# Altium schematic sheet 08_nRF_RAM.SchDoc: SENSEI Base Board - nRF RAM
size A3; DrawnBy: Sebastian Frey; Organization: Integrated Systems Laboratory; DocumentNumber: 9; Revision: v1.1; SheetNumber: 9; SheetTotal: 12
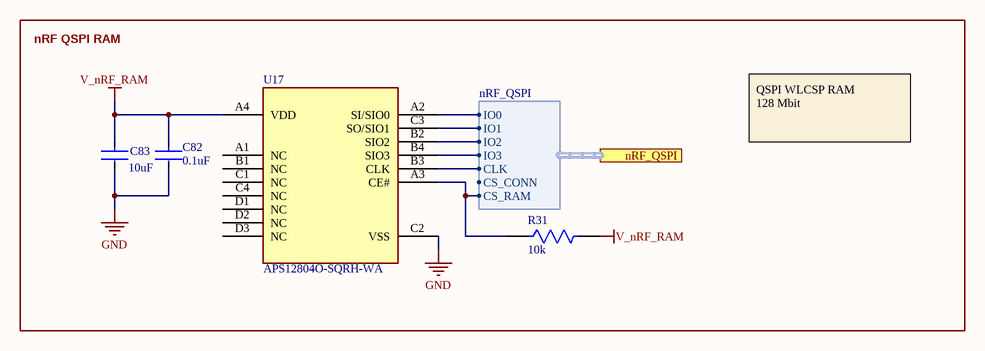
[diagram p0: 08_nRF_RAM.SchDoc]

## Parts
C82  Capacitance: 0.1uF  [FP-GRM033-0_03-IPC_C]  (hidden comment: GRM033Z71C104KE14D)
C83  Capacitance: 10uF  [FP-CL05A106MP5NUNC-IPC_C]  (hidden comment: CL05A106MP5NUNC)
R31  Resistance: 10k  [FP-RMCF0201-IPC_C]  (hidden comment: RMCF0201FT10K0)
U17  APS12804O-SQRH-WA  [APS12804O-SQRH-WA]

## Blocks framed on the sheet
nRF QSPI RAM: C82 C83 R31 U17

## Ports
nRF_QSPI (harness nRF_QSPI)

## Harnesses
nRF_QSPI: IO0, IO1, IO2, IO3, CLK, CS_CONN, CS_RAM

## Nets
GND: C82.2 C83.2 U17.C2(VSS)
V_nRF_RAM: C82.1 C83.1 R31.2 U17.A4(VDD)
NetR31_1: R31.1 U17.A3(CE#) ; port nRF_QSPI.CS_RAM
NetU17_A2: U17.A2(SI/SIO0) ; port nRF_QSPI.IO0
NetU17_B2: U17.B2(SIO2) ; port nRF_QSPI.IO2
NetU17_B3: U17.B3(CLK) ; port nRF_QSPI.CLK
NetU17_B4: U17.B4(SIO3) ; port nRF_QSPI.IO3
NetU17_C3: U17.C3(SO/SIO1) ; port nRF_QSPI.IO1

Not connected (* = marked no-connect by the designer): U17 A1(NC) B1(NC) C1(NC) C4(NC) D1(NC) D2(NC) D3(NC)

## Notes on the sheet
- QSPI WLCSP RAM
  128 Mbit
- 1
- 2
- 3
- 4
- 5
- 6
- 7
- 8
- A
- B
- C
- D
- Project:
- Date:
- Drawing number:
- Rev:
- Format:
- A3
- Drawn by:
- Laboratory:
- Page
- Sheet:
- of
- File:

## Library data of the parts
C82 = CMP-06035-035508-1: Chip Multilayer Ceramic Capacitors for General Purpose, 0201, 0.10uF, X7R, 15%, 10%, 16V; Case/Package: 0201
C83 = CMP-13271-000002-1: CAP CER 10UF 10V X5R 0402; Manufacturer: Samsung; Temperature Coefficient: 15%; Tolerance: 20%; Material: Ceramic; Octopart: https://octopart.com/cl05a106mp5nunc-samsung-22457395; Voltage Rating: 10V; RoHS: TRUE; Value: 10uF; Height: 0.7mm; Digikey Description: CAP CER 10UF 10V X5R 0402; Automotive: No; Package: CL05A106MP5NUNC; Device Class L1: Passive Components; Temperature Range High: +85°C; ComponentLink2Description: Datasheet; Device Class L2: Capacitors; Temperature Characteristic: X5R; Manufacturer Part Number: CL05A106MP5NUNC; Temperature: -55°C to +85°C; ComponentLink2URL: http://www.samsungsem.com/kr/support/product-search/mlcc/__icsFiles/afieldfile/2019/05/10/19-CL05A106MP5NUNC.pdf; Device Class L3: Ceramic Capacitors; Category: Cap; Temperature Range Low: -55°C; Ipc Land Pattern Name: CAPC10050X50; Lead Free: Yes
R31 = CMP-26527-002755-1: RES 10K OHM 1% 1/20W 0201; Max Power Dissipation: 50mW; Temperature Coefficient: 200ppm/°C; Length: 0.024inch; Min Operating Temperature: -55°C; Width: 0.012inch; Contact Plating: Tin; Case/Package: 0201; Power Rating: 50mW; Packaging: Tape and Reel; Resistor Type: Thick Film; Case Code (Metric): 0603; Tolerance: 1%; Case Code (Imperial): 0201; Max Operating Temperature: 125°C; Height: 0.009inch; Mount: Surface Mount; Series: RMCF; RoHS Compliant: Yes; Number of Terminations: 2
U17 = APS12804O-SQRH-WA: QSPI PSRAM in WLCSP package / 144 MHz / 128 Mbit; Mfr_Name: AP Memory; Manufacturer_Part_Number: APS12804O-SQRH-WA